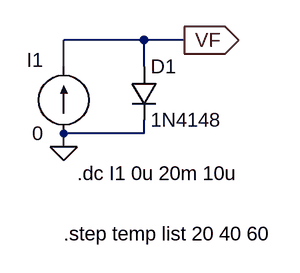
[diagram p0: schematic diode_sweep.asc]
diode_sweep.asc, the LTspice schematic file:
Version 4
SHEET 1 880 680
WIRE 96 144 0 144
WIRE 144 144 96 144
WIRE 0 176 0 144
WIRE 96 176 96 144
WIRE 96 256 96 240
WIRE 96 256 0 256
WIRE 0 272 0 256
FLAG 0 272 0
FLAG 144 144 VF
IOPIN 144 144 Out
SYMBOL current 0 256 R180
WINDOW 0 24 88 Left 0
WINDOW 3 24 0 Left 0
WINDOW 123 0 0 Left 0
WINDOW 39 0 0 Left 0
SYMATTR InstName I1
SYMATTR Value 0
SYMBOL diode 80 176 R0
SYMATTR InstName D1
SYMATTR Value 1N4148
TEXT 16 304 Left 0 !.dc I1 0u 20m 10u
TEXT 0 376 Left 0 !.step temp list 20 40 60

The netlist it stands for:
* diode_sweep.asc
I1 0 VF 0
D1 VF 0 1N4148
.model D D
.lib standard.dio
.dc I1 0u 20m 10u
.step temp list 20 40 60
.backanno
.end